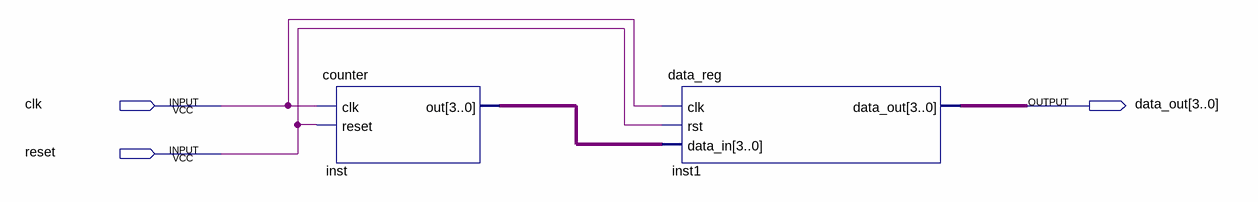
[diagram p0: schematic sheet]
// Quartus schematic block.bdf as structural Verilog: 2 symbols, 3 pins
module block (
  input  clk,
  input  reset,
  output [3:0] data_out
);

  wire [3:0] inst_out;

  counter inst (.clk(clk), .reset(reset), .out(inst_out));
  data_reg inst1 (.clk(clk), .rst(reset), .data_in(inst_out), .data_out(data_out));
endmodule
